# EAGLE design TPS61032 (EAGLE 9.0.0)
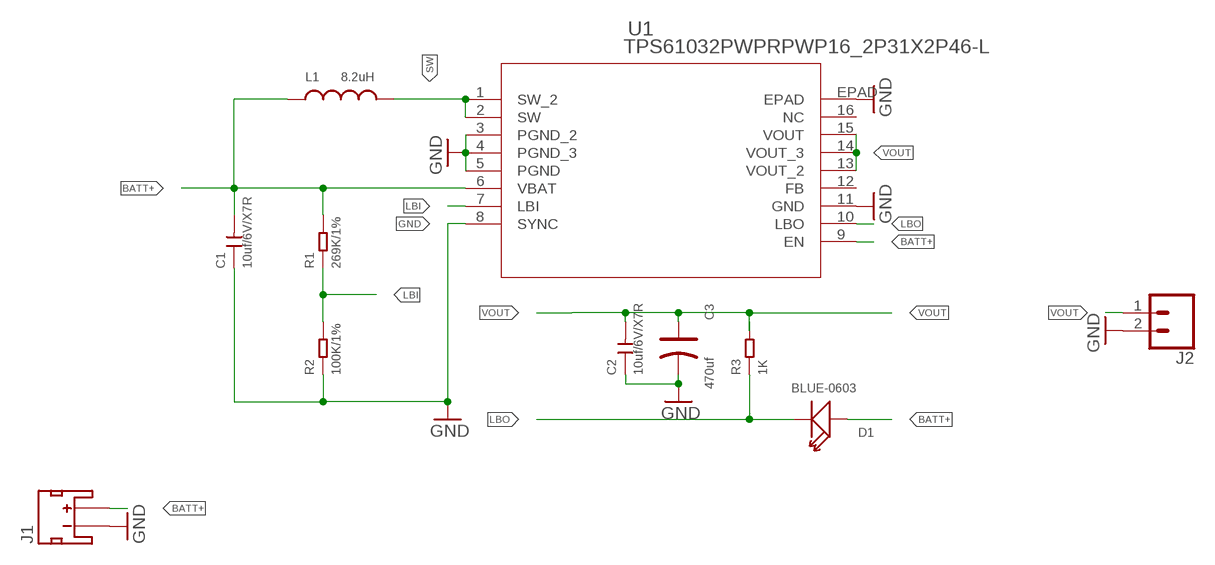
[diagram p0: schematic, sheet 1]

## Parts
C1  10uf/6V/X7R  CERAMIC-10UF-10V-(-20%～+80%)-Y5V(0805)  [C0805]
C2  10uf/6V/X7R  CERAMIC-10UF-10V-(-20%～+80%)-Y5V(0805)  [C0805]
C3  470uf  TANTALUM-SMD-470UF-6.3V(AVX-D)  [AVX-D]
D1  BLUE-0603  SMD-LED-CLEAR-BLUE(0603)  [LED-0603]
J1  JST_2MM_MALE  [JST-2-SMD]
J2  CONN_02PTH4  [1X02_XTRA_BIG]
L1  8.2uH  LWE-HCI-13MM  [7443550820]
R1  269K/1%  SMD-RES-220R-5%-1/8W(0805)  [R0805]
R2  100K/1%  SMD-RES-220R-5%-1/8W(0805)  [R0805]
R3  1K  SMD-RES-1K-1%-1/10W(0603)  [R0603]
U1  TPS61032PWPRPWP16_2P31X2P46-L  [PWP16_2P31X2P46-L]

## Nets
BATT+: C1.2 D1.+ J1.2(+) L1.1 R1.2 U1.6(VBAT) U1.9(EN)
GND: C1.1 C2.1 C3.- J1.1(-) J2.2 R2.1 U1.3(PGND_2) U1.4(PGND_3) U1.5(PGND) U1.8(SYNC) U1.11(GND) U1.EPAD
LBI: R1.1 R2.2 U1.7(LBI)
LBO: D1.- R3.1 U1.10(LBO)
SW: L1.2 U1.1(SW_2) U1.2(SW)
VOUT: C2.2 C3.+ J2.1 R3.2 U1.13(VOUT_2) U1.14(VOUT_3) U1.15(VOUT)
Unconnected: J1.NC1(PAD1) J1.NC2(PAD2) U1.12(FB) U1.16(NC)

## Library data of the parts
C1 C2 = Seeed-Capacitor:CERAMIC-10UF-10V-(-20%～+80%)-Y5V(0805): 302010158; MPN: CC0805ZKY5V6BB106; VALUE: 10uf
C3 = Seeed-Capacitor:TANTALUM-SMD-470UF-6.3V(AVX-D): 302020027; MPN: TAJD477*006#NJ
D1 = Seeed-LED:SMD-LED-CLEAR-BLUE(0603): 304090045; MPN: 19-217-BHC-ZL1M2RY-3T
J1 = SparkFun-Connectors:JST_2MM_MALE: JST 2MM MALE RA CONNECTOR Two pin, compact surface mount connector. Commonly used as a battery input connection point. We really like the solid locking feeling and high current rating on these small connectors. We use these all the time as battery connectors. Mates to single-cell LiPo batteries. Here is the connector we sell at SparkFun: JST Right Angle Connector - White <https://www.sparkfun.com/products/8612> (PRT-08612) Datasheet <http://www.sparkfun.com/datasheets/Prototyping/Connectors/JST-Horizontal.pdf> It was used on these SparkFun products: SparkFun MOSFET Power Controller <https://www.sparkfun.com/products/11214> (PRT-11214) SparkFun Battery Babysitter - LiPo Battery Manager <https://www.sparkfun.com/products/13777> (PRT-13777) And many, many others that required a lipo battery connection.; PROD_ID: CONN-11443; SF_ID: PRT-08612
J2 = SparkFun-Connectors:CONN_02: Multi connection point. Often used as Generic Header-pin footprint for 0.1 inch spaced/style header connections On any of the 0.1 inch spaced packages, you can populate with these: Break Away Headers - Straight <https://www.sparkfun.com/products/116> (PRT-00116) Break Away Male Headers - Right Angle <https://www.sparkfun.com/products/553> (PRT-00553) Female Headers <https://www.sparkfun.com/products/115> (PRT-00115) Break Away Headers - Machine Pin <https://www.sparkfun.com/products/117> (PRT-00117) Break Away Female Headers - Swiss Machine Pin <https://www.sparkfun.com/products/743> (PRT-00743) For SCREWTERMINALS and SPRING TERMINALS visit here: Screw Terimnals on SparkFun.com <https://www.sparkfun.com/search/results?term=Screw+Terminals> (5mm/3.5mm/2.54mm spacing) This device is also useful as a general connection point to wire up your design to another part of your project. Our various solder wires solder well into these plated through hole pads. Hook-Up Wire - Assortment (Stranded, 22 AWG) <https://www.sparkfun.com/products/11375> (PRT-11375) Hook-Up Wire - Assortment (Solid Core, 22 AWG) <https://www.sparkfun.com/products/11367> (PRT-11367) View the entire wire category on our website here <https://www.sparkfun.com/categories/141> Special notes: Molex polarized connector foot print use with: PRT-08233 with associated crimp pins and housings. 2.54_SCREWTERM for use with PRT-10571. 3.5mm Screw Terminal footprints for PRT-08084 5mm Screw Terminal footprints for use with PRT-08432
L1 = mw-wurth:L
R1 R2 = Seeed-Resistor:SMD-RES-220R-5%-1/8W(0805): 301010315; MPN: RC0805JR-07220RL; VALUE: 220R
R3 = Seeed-Resistor:SMD-RES-1K-1%-1/10W(0603): 301010298; MPN: RC0603FR-071KL
U1 = 32teeth - TPS61030-32:TPS61032PWPR; MANUFACTURER_PART_NUMBER: TPS61032PWPR; VENDOR: Texas Instruments

## Board
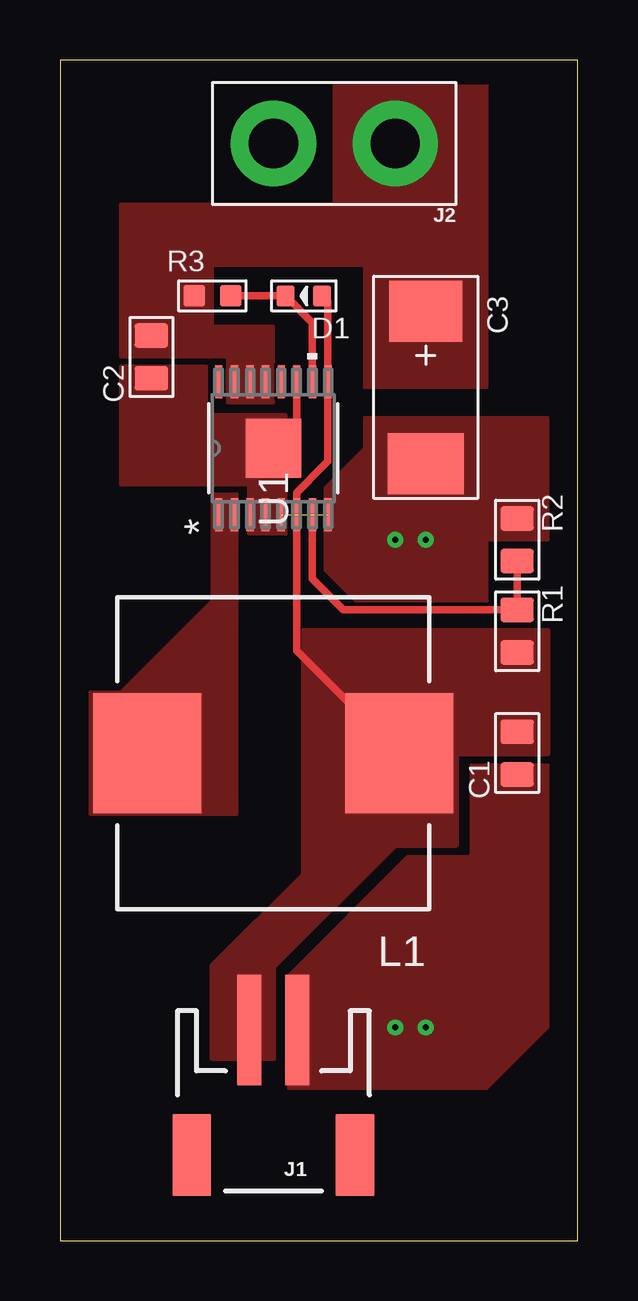
[diagram p1: board, top side]
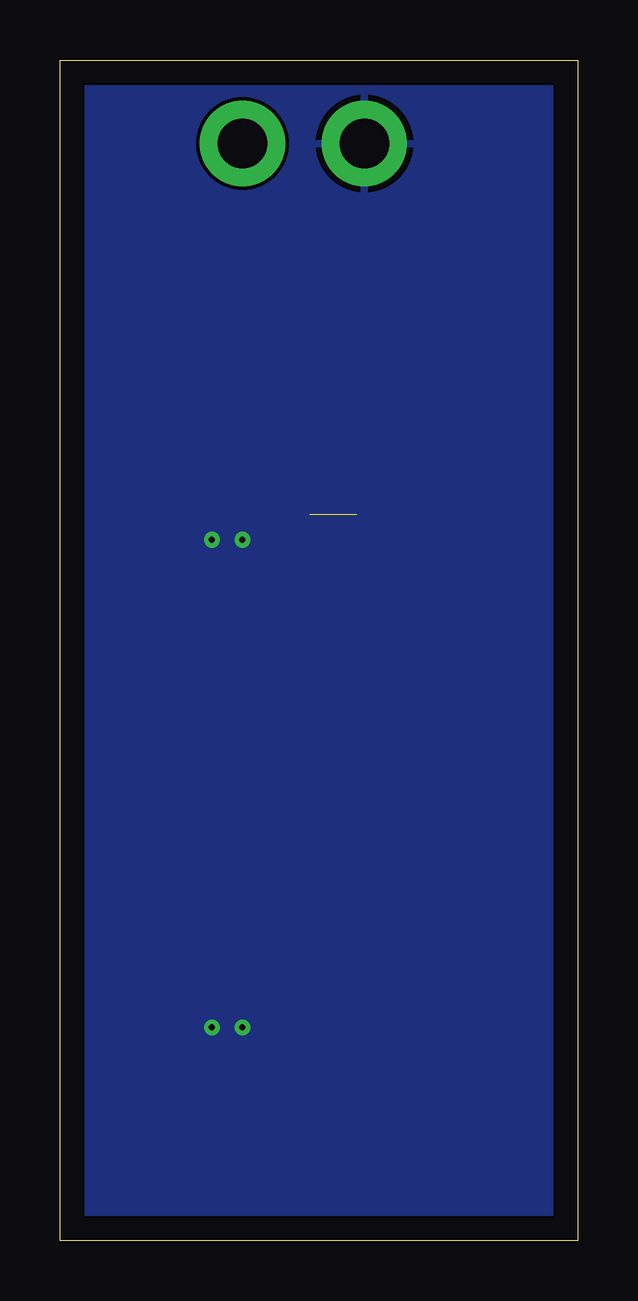
[diagram p2: board, bottom side, seen from below]

Size 21.57 x 49.2 mm. Coordinates in mm from the lower left corner, seen from the top.
Outline: 0,0 21.57,0 21.57,49.2 0,49.2 0,0
Copper layers (1*16): Top 0.035mm / dielectric 1.5mm / Bottom 0.035mm
Design rules "default": minimum track width 6mil, minimum drill 0.35mm, track to track 6mil, track to pad 6mil, pad to pad 6mil, via to via 6mil, smd to smd 6mil, copper to edge 40mil, drill to drill 6mil, minimum pad ring 10mil, minimum via ring 8mil, stop-mask expansion 4mil, vias tented up to drill 0mil, thermal gap 10mil

### Footprints (pad centres in the part's own frame; a part is rotated, then mirrored left to right if it is on the bottom)
C0805 = smd 1.397 x 1.016: 1 0,0.889; 2 0,-0.889
AVX-D = smd 2.54 x 3.048: + -3.175,0 | smd 2.54 x 3.175: - 3.175,0
LED-0603 = smd 0.762 x 0.889: + -0.762,0; - 0.762,0
JST-2-SMD = smd 1 x 4.6: 1 -1,-3.7; 2 1,-3.7 | smd 1.6 x 3.4: NC1 -3.4,1.5; NC2 3.4,1.5
1X02_XTRA_BIG = drill 2.057 pad 3.556: 1 -2.54,0; 2 2.54,0
7443550820 = smd 4.5 x 5: 1 -5.25,0; 2 5.25,0
R0805 = smd 1.397 x 1.016: 1 0,0.889; 2 0,-0.889
R0603 = smd 0.889 x 0.889: 1 0,0.762; 2 0,-0.762
PWP16_2P31X2P46-L = smd 1.372 x 0.305: 1 -2.769,2.275; 2 -2.769,1.625; 3 -2.769,0.975; 4 -2.769,0.325; 5 -2.769,-0.325; 6 -2.769,-0.975; 7 -2.769,-1.625; 8 -2.769,-2.275; 9 2.769,-2.275; 10 2.769,-1.625; 11 2.769,-0.975; 12 2.769,-0.325; 13 2.769,0.325; 14 2.769,0.975; 15 2.769,1.625; 16 2.769,2.275 | smd 2.46 x 2.31: EPAD 0,0

### Placement (x,y rotation side)
C1  19.05,20.32 180 top
C2  3.81,36.83 180 top
C3  15.24,35.56 270 top
D1  10.16,39.37 180 top
J1  8.89,5.08 180 top
J2  11.43,45.72 180 top
L1  8.89,20.32 180 top
R1  19.05,25.4 0 top
R2  19.05,29.21 0 top
R3  6.35,39.37 270 top
U1  8.89,33.02 90 top

### Tracks (layer width: path | path; a pad name or v marks a point on that pad's centre or on a via)
BATT+
  Top 0.305: L1.1 9.87,24.59 U1.6 9.87,31.18 10.93,32.25 | D1.+ 11.17,39.13 U1.9 11.17,32.48 10.93,32.25 | 10.97,32.29 10.93,32.25
  pour Top (no thermals): 6.35,7.62 8.89,7.62 8.89,11.43 13.97,16.51 16.51,16.51 16.51,20.32 20.32,20.32 20.32,25.4 10.16,25.4 10.16,19.05 10.16,15.24 6.35,11.43
GND  (via drill 0.25)  (1 unrouted)
  Top 0.305: U1.11 9.87,33.02 U1.EPAD
  other vias: 13.97,29.21 15.24,29.21 15.24,8.89 13.97,8.89
  pour Bottom: 0,0 0,49.53 21.59,49.53 21.59,0
  pour Top (no thermals): 2.54,31.5 2.54,36.45 6.1,36.45 6.1,34.42 9.4,34.42 9.4,29.46 7.87,29.46 7.87,31.5
  pour Top (no thermals): 12.7,34.29 20.32,34.29 20.32,29.21 17.78,29.21 17.78,26.67 12.32,26.67 11.05,27.94 11.05,31.37 11.43,31.75 12.7,33.02
  pour Top (no thermals): 10.16,6.35 17.78,6.35 20.32,8.89 20.32,19.81 17.14,19.81 17.14,16 14.48,16 9.53,11.05 9.53,6.35
LBI
  Top 0.305: U1.7 10.52,27.59 11.81,26.29 R1.1 R2.2
LBO
  Top 0.305: U1.10 10.52,38.25 D1.- R3.1
SW
  pour Top (no thermals): 1.27,17.78 7.37,17.78 7.37,31.11 6.35,31.11 6.35,26.67 2.54,22.86 1.27,22.86
VOUT
  pour Top (no thermals): 11.43,48.26 17.78,48.26 17.78,35.56 12.7,35.56 12.7,40.64 6.35,40.64 6.35,38.1 8.89,38.1 8.89,34.92 6.99,34.92 6.99,36.83 2.54,36.83 2.54,43.18 11.43,43.18